# Altium schematic sheet nodequad_shield_2022-03-13.schdoc
size 292 x 171 mm
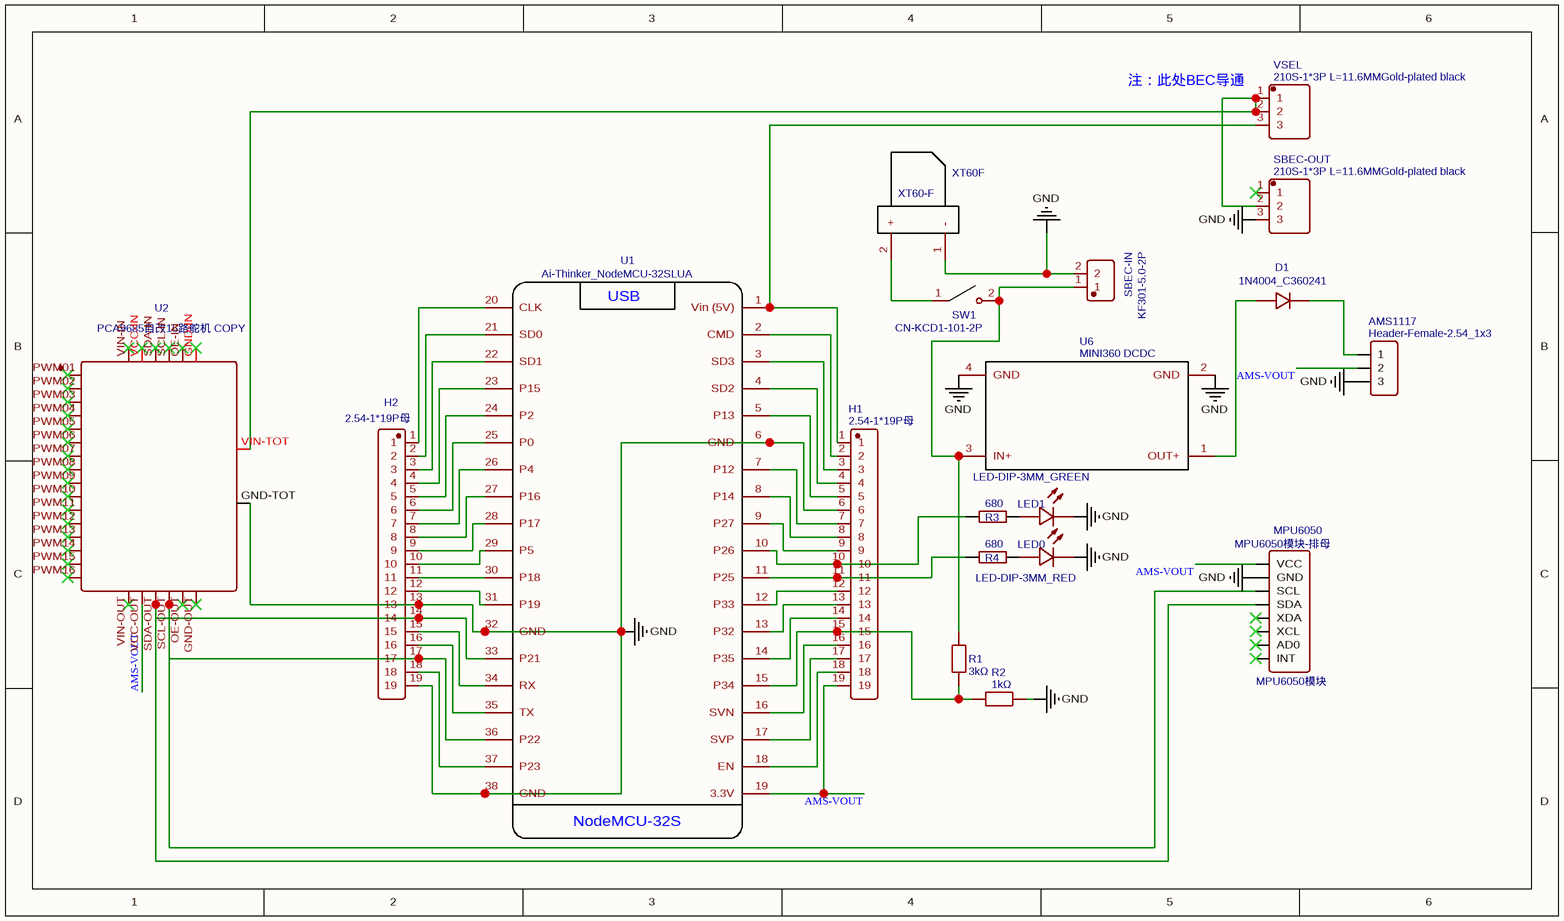
[diagram p0: nodequad_shield_2022-03-13.schdoc]

## Parts
AMS1117  Header-Female-2.54_1x3  [HDR-TH_3P-P2.54-V-F]
D1  1N4004_C360241  [DO-41_BD2.4-L4.7-P8.70-D0.9-RD]
H1  2.54-1*19P母  [HDR-TH_19P-P2.54-V-F]
H2  2.54-1*19P母  [HDR-TH_19P-P2.54-V-F]
LED0  LED-DIP-3MM_RED  [LED-TH_BD4.1-P2.00-D0.5-RD_RED]
LED1  LED-DIP-3MM_GREEN  [LED-TH_BD4.1-P2.00-D0.6-RD_GREEN]
MPU6050  MPU6050模块-排母  [MPU6050模块-排母-PCB]
R1  3kΩ  [RES-TH_BD2.3-L6.5-P10.50-D0.5]
R2  1kΩ  [RES-TH_BD2.3-L6.5-P10.50-D0.5]
R3  680  [RES-TH_BD2.2-L6.5-P10.50-D0.6]
R4  680  [RES-TH_BD2.2-L6.5-P10.50-D0.6]
SBEC-IN  KF301-5.0-2P  [CONN-TH_P5.00_KF301-5.0-2P]
SBEC-OUT  210S-1*3P L=11.6MMGold-plated black  [HDR-TH_3P-P2.54-V-M-1]
SW1  CN-KCD1-101-2P  [SW-TH_CN-KCD3-2P]
U1  Ai-Thinker_NodeMCU-32SLUA  [AI-THINKER_NODEMCU-32SLUA]
U2  PCA9685自改16路舵机 COPY  [PCA9685]
U6  MINI360 DCDC  [MINI360]
VSEL  210S-1*3P L=11.6MMGold-plated black  [HDR-TH_3P-P2.54-V-M-1]
XT60F  XT60-F  [XT60PB-F]

## Nets
GND: AMS1117.3 H1.6 H2.13 H2.19 LED0.1 LED1.1 MPU6050.2(GND) R2.2 SBEC-IN.2 SBEC-OUT.3 U1.6(GND) U1.32(GND) U1.38(GND) U2.GND-TOT(GND) U6.2(GND) U6.4(GND) XT60F.1(-)
AMS-VOUT: AMS1117.2 H1.19 MPU6050.1(VCC) U1.19(3.3V) U2.VCC-OUT
NetAMS1117_1: AMS1117.1 D1.1(-)
NetD1_2: D1.2(+) U6.1(OUT+)
NetH1_1: H1.1 U1.1(Vin_(5V)) VSEL.3
NetH1_2: H1.2 U1.2(CMD)
NetH1_3: H1.3 U1.3(SD3)
NetH1_4: H1.4 U1.4(SD2)
NetH1_5: H1.5 U1.5(P13)
NetH1_7: H1.7 U1.7(P12)
NetH1_8: H1.8 U1.8(P14)
NetH1_9: H1.9 U1.9(P27)
NetH1_10: H1.10 R3.1 U1.10(P26)
NetH1_11: H1.11 R4.1 U1.11(P25)
NetH1_12: H1.12 U1.12(P33)
NetH1_13: H1.13 U1.13(P32)
NetH1_14: H1.14 U1.14(P35)
NetH1_15: H1.15 R1.1 R2.1 U1.15(P34)
NetH1_16: H1.16 U1.16(SVN)
NetH1_17: H1.17 U1.17(SVP)
NetH1_18: H1.18 U1.18(EN)
NetH2_1: H2.1 U1.20(CLK)
NetH2_2: H2.2 U1.21(SD0)
NetH2_3: H2.3 U1.22(SD1)
NetH2_4: H2.4 U1.23(P15)
NetH2_5: H2.5 U1.24(P2)
NetH2_6: H2.6 U1.25(P0)
NetH2_7: H2.7 U1.26(P4)
NetH2_8: H2.8 U1.27(P16)
NetH2_9: H2.9 U1.28(P17)
NetH2_10: H2.10 U1.29(P5)
NetH2_11: H2.11 U1.30(P18)
NetH2_12: H2.12 U1.31(P19)
NetH2_14: H2.14 MPU6050.4(SDA) U1.33(P21) U2.SDA-OUT
NetH2_15: H2.15 U1.34(RX)
NetH2_16: H2.16 U1.35(TX)
NetH2_17: H2.17 MPU6050.3(SCL) U1.36(P22) U2.SCL-OUT
NetH2_18: H2.18 U1.37(P23)
NetLED0_2: LED0.2 R4.2
NetLED1_2: LED1.2 R3.2
NetR1_2: R1.2 SBEC-IN.1 SW1.2 U6.3(IN+)
NetSBEC-OUT_2: SBEC-OUT.2 U2.VIN-TOT(VPOWER) VSEL.1 VSEL.2
NetSW1_1: SW1.1 XT60F.2(+)

Not connected (* = marked no-connect by the designer): MPU6050 5(XDA)* 6(XCL)* 7(AD0)* 8(INT)*; SBEC-OUT 1*; U2 GND-IN(V+)* GND-OUT(1)* OE-IN(2)* OE-OUT(1)* PWM01(9)* PWM02(9)* PWM03(9)* PWM04(9)* PWM05(9)* PWM06(9)* PWM07(9)* PWM08(9)* PWM09(9)* PWM10(9)* PWM11(9)* PWM12(9)* PWM13(9)* PWM14(9)* PWM15(9)* PWM16(9)* SCL-IN(3)* SDA-IN(4)* VCC-IN(VCC)* VIN-IN(1)* VIN-OUT(1)*

## Notes on the sheet
- 注：此处BEC导通
- (in symbol Ai-Thinker_NodeMCU-32SLUA) USB; NodeMCU-32S
- (in symbol MPU6050模块-排母) MPU6050模块

## Library data of the parts
AMS1117 = Header-Female-2.54_1x3: BOM_Manufacturer: Boom Precision Elec; BOM_Supplier Part: C146243; BOM_Supplier: LCSC; BOM_Manufacturer Part: Header-Female-2.54_1x3; link: https://datasheet.lcsc.com/szlcsc/Boom-Precision-Elec-2-54mm-1-8P-Straight-Female-header_C27438.pdf; BOM_JLCPCB Part Class: Extended Part; spicePre: P; spiceSymbolName: Header-Female-2.54_1x3
D1 = 1N4004_C360241: BOM_Manufacturer: Chongqing Pingwei Tech; BOM_Manufacturer Part: 1N4004; Contributor: LCSC; BOM_Supplier: LCSC; BOM_Supplier Part: C360241; BOM_JLCPCB Part Class: Extended Part; spicePre: D; spiceSymbolName: 1N4004_C360241
H1 H2 = 2.54-1*19P母: BOM_Manufacturer: BOOMELE(博穆精密); Contributor: LCSC; BOM_Supplier: LCSC; BOM_Supplier Part: C319202; BOM_Manufacturer Part: 2.54-1*19P母; BOM_JLCPCB Part Class: Extended Part; spicePre: H; spiceSymbolName: 2.54-1*19P母
LED0 = LED-DIP-3MM_RED: BOM_Manufacturer: null; Contributor: LCSC; BOM_Supplier: LCSC; BOM_Supplier Part: C9900002364; BOM_Manufacturer Part: LED-DIP-3MM_Red; BOM_JLCPCB Part Class: Extended Part; spicePre: U; spiceSymbolName: LED-DIP-3MM_RED
LED1 = LED-DIP-3MM_GREEN: Contributor: LCSC; Package Display: No; BOM_Supplier: LCSC; BOM_Supplier Part: C9900002365; BOM_Manufacturer Part: LED-DIP-3MM_Green; BOM_JLCPCB Part Class: Extended Part; link: https://detail.tmall.com/item.htm?spm=a230r.1.14.18.4f1e3ae3L2RF3M&id=619255804030&ns=1&abbucket=5; spicePre: L; spiceSymbolName: LED-DIP-3MM_GREEN
MPU6050 = MPU6050模块-排母: Contributor: W429367425; spicePre: U; spiceSymbolName: MPU6050模块-排母
R1 = 3kΩ: BOM_Manufacturer: Huaxing Mechanical-Elec.; BOM_Manufacturer Part: MF1/4W-3KΩ±1%T52; nameAlias: Resistance (Ohms); Contributor: LCSC; BOM_Supplier: LCSC; BOM_Supplier Part: C714005; Resistance: 3kΩ; BOM_JLCPCB Part Class: Extended Part; spicePre: R; spiceSymbolName: MF1/4W-3KΩ±1%T52
R2 = 1kΩ: BOM_Manufacturer: Huaxing Mechanical-Elec.; BOM_Manufacturer Part: MF1/4W-1KΩ±1%T52; nameAlias: Resistance (Ohms); Contributor: LCSC; BOM_Supplier: LCSC; BOM_Supplier Part: C713997; BOM_JLCPCB Part Class: Extended Part; Resistance: 1kΩ; spicePre: R; spiceSymbolName: MF1/4W-1KΩ±1%T52
R3 R4 = 680: BOM_Manufacturer: FlyWin; nameAlias: Resistance (Ohms); Contributor: LCSC; Resistance: 680Ω; BOM_Supplier: LCSC; BOM_Supplier Part: C337184; BOM_Manufacturer Part: -; BOM_JLCPCB Part Class: Extended Part; spicePre: R; spiceSymbolName: MF1/4W ±1% 680Ω STB5
SBEC-IN = KF301-5.0-2P: BOM_Manufacturer: Cixi Kefa Elec; Contributor: LCSC; BOM_Supplier: LCSC; BOM_Supplier Part: C474881; BOM_Manufacturer Part: KF301-5.0-2P; BOM_JLCPCB Part Class: Extended Part; spicePre: U; spiceSymbolName: KF301-5.0-2P
SBEC-OUT VSEL = 210S-1*3P L=11.6MMGold-plated black: BOM_Manufacturer: Ckmtw; Contributor: LCSC; BOM_Supplier: LCSC; BOM_Manufacturer Part: 210S-1*3P L=11.6MMGold-plated black; BOM_Supplier Part: C124376; BOM_JLCPCB Part Class: Extended Part; spicePre: H; spiceSymbolName: 210S-1*3P L=11.6MMGold-plated black
SW1 = CN-KCD1-101-2P: BOM_Manufacturer: null; Contributor: LCSC; BOM_Supplier: LCSC; BOM_Supplier Part: C9900002516; BOM_Manufacturer Part: CN-KCD1-101-2P; BOM_JLCPCB Part Class: Extended Part; spicePre: S; spiceSymbolName: CN-KCD1-101-2P
U1 = Ai-Thinker_NodeMCU-32SLUA: Contributor: jobsonp checked by LCSC; spicePre: X; BOM_Supplier: LCSC; BOM_Supplier Part: C111436; BOM_Manufacturer: Ai-Thinker; BOM_Manufacturer Part: NodeMCU-32SLua; spiceSymbolName: Ai-Thinker_NodeMCU-32SLUA
U2 = PCA9685自改16路舵机 COPY: BOM_Manufacturer Part: New SchematicLib; Contributor: hbyd110; spicePre: U; spiceSymbolName: PCA9685自改16路舵机 COPY
U6 = MINI360 DCDC: Contributor: libc0607; spicePre: U; spiceSymbolName: MINI360 DCDC
XT60F = XT60-F: Contributor: ZhangYonghui; spicePre: U; spiceSymbolName: XT60-F